# EAGLE design Bugboard (EAGLE 6.6.0)
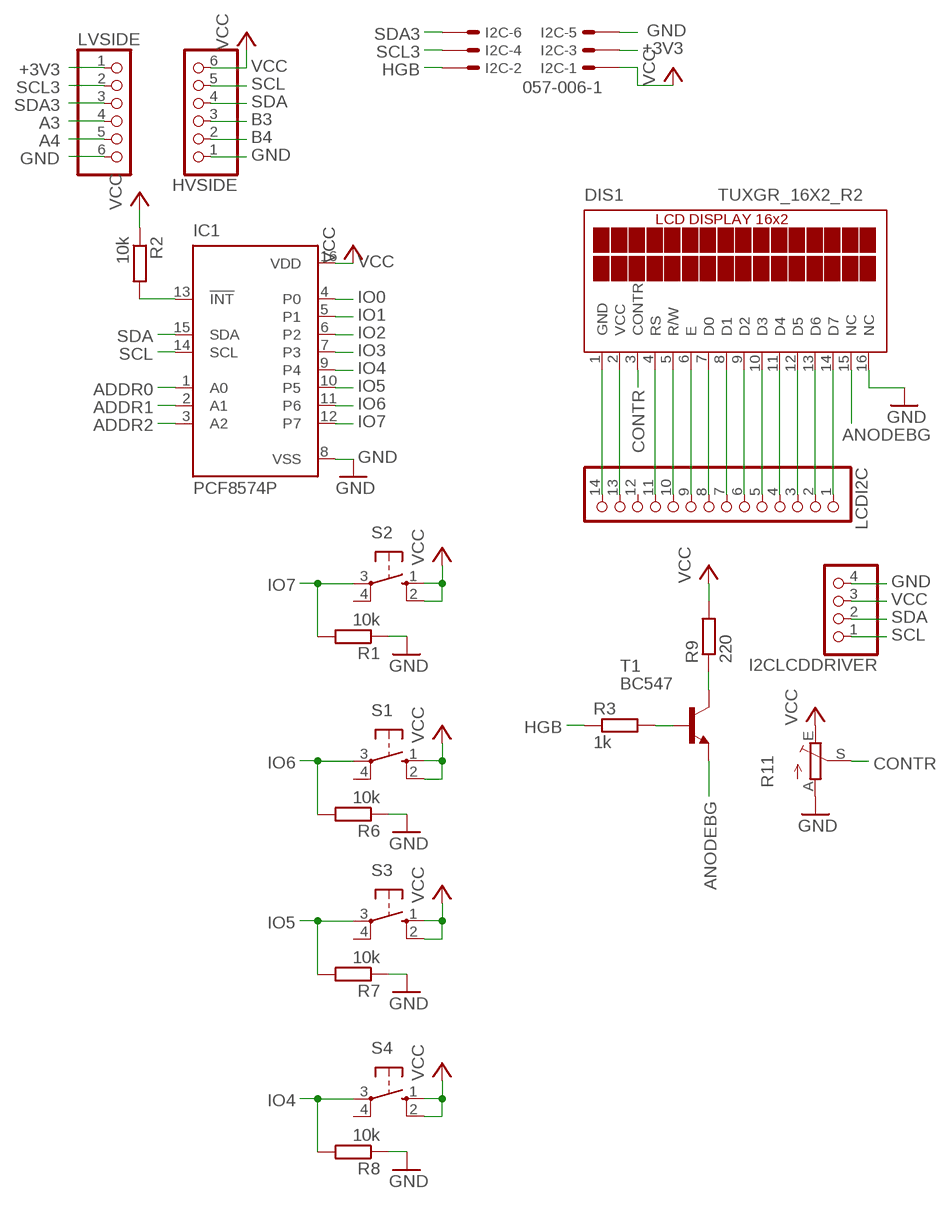
[diagram p0: schematic, sheet 1]

## Parts
DIS1  TUXGR_16X2_R2  [TUXGR_16X2_R2]
HVSIDE  PINHD-1X6  [1X06]
I2C  057-006-1  [057-006-1]
I2CLCDDRIVER  PINHD-1X4  [1X04]
IC1  PCF8574P  [DIL16]
LCDI2C  PINHD-1X14  [1X14]
LVSIDE  PINHD-1X6  [1X06]
R1  10k  R-EU_0204/7  [0204/7]
R2  10k  R-EU_0204/7  [0204/7]
R3  1k  R-EU_0207/12  [0207/12]
R6  10k  R-EU_0204/7  [0204/7]
R7  10k  R-EU_0204/7  [0204/7]
R8  10k  R-EU_0204/7  [0204/7]
R9  220  R-EU_0204/7  [0204/7]
R11  TRIM_EU-B64Y  [B64Y]
S1  10-XX  [B3F-10XX]
S2  10-XX  [B3F-10XX]
S3  10-XX  [B3F-10XX]
S4  10-XX  [B3F-10XX]
T1  BC547  [TO92]

## Nets
+3V3: I2C.3 LVSIDE.1
A3: LVSIDE.4
A4: LVSIDE.5
ADDR0: IC1.1(A0)
ADDR1: IC1.2(A1)
ADDR2: IC1.3(A2)
ANODEBG: DIS1.15(NC) T1.1(E)
B3: HVSIDE.3
B4: HVSIDE.2
CONTR: DIS1.3(CONTR) R11.S
GND: DIS1.1(GND) DIS1.16(NC) HVSIDE.1 I2C.5 I2CLCDDRIVER.4 IC1.8(VSS) LCDI2C.14 LVSIDE.6 R1.1 R6.1 R7.1 R8.1 R11.A
HGB: I2C.2 R3.1
IO0: IC1.4(P0)
IO1: IC1.5(P1)
IO2: IC1.6(P2)
IO3: IC1.7(P3)
IO4: IC1.9(P4) R8.2 S4.3(P)
IO5: IC1.10(P5) R7.2 S3.3(P)
IO6: IC1.11(P6) R6.2 S1.3(P)
IO7: IC1.12(P7) R1.2 S2.3(P)
N$1: IC1.13(!INT) R2.2
N$2: DIS1.14(D7) LCDI2C.1
N$3: DIS1.13(D6) LCDI2C.2
N$4: DIS1.12(D5) LCDI2C.3
N$5: DIS1.11(D4) LCDI2C.4
N$6: DIS1.10(D3) LCDI2C.5
N$7: DIS1.9(D2) LCDI2C.6
N$8: DIS1.8(D1) LCDI2C.7
N$9: DIS1.7(D0) LCDI2C.8
N$10: DIS1.6(E) LCDI2C.9
N$11: DIS1.5(R/W) LCDI2C.10
N$12: DIS1.4(RS) LCDI2C.11
N$13: R9.1 T1.3(C)
N$14: R3.2 T1.2(B)
SCL: HVSIDE.5 I2CLCDDRIVER.1 IC1.14(SCL)
SCL3: I2C.4 LVSIDE.2
SDA: HVSIDE.4 I2CLCDDRIVER.2 IC1.15(SDA)
SDA3: I2C.6 LVSIDE.3
VCC: DIS1.2(VCC) HVSIDE.6 I2C.1 I2CLCDDRIVER.3 IC1.16(VDD) LCDI2C.13 R2.1 R9.2 R11.E S1.1(S) S1.2(S1) S2.1(S) S2.2(S1) S3.1(S) S3.2(S1) S4.1(S) S4.2(S1)
Unconnected: LCDI2C.12 S1.4(P1) S2.4(P1) S3.4(P1) S4.4(P1)

## Library data of the parts
DIS1 = display-lcd:TUXGR_16X2_R2: Tuxgraphics LCD display 16x2 characters reflective, without background light Source: tuxgr_12x2_r2.pdf; OC_FARNELL: unknown; OC_NEWARK: unknown
HVSIDE LVSIDE = pinhead:PINHD-1X6: PIN HEADER
I2C = con-panduit:057-006-: CONNECTOR 6-pin series 057 contact pc board low profile headers; OC_FARNELL: unknown; OC_NEWARK: unknown
I2CLCDDRIVER = pinhead:PINHD-1X4: PIN HEADER
IC1 = micro-philips:PCF8574: I2C-Bus Remote 8-bit I/O expander http://www.semiconductors.philips.com/acrobat_download/datasheets/PCF8574_4.pdf; MPN: PCF8574PN; OC_FARNELL: 204020; OC_NEWARK: 11N8515
LCDI2C = pinhead:PINHD-1X14: PIN HEADER
R1-R3 R6-R9 = resistor:R-EU_: RESISTOR, European symbol
R11 = pot:TRIM_EU-: POTENTIOMETER
S1-S4 = switch-omron:10-XX: OMRON SWITCH; MPN: B3F-1000; OC_FARNELL: 176432; OC_NEWARK: 36M3542
T1 = transistor:BC547: NPN TRANSISTOR

## Board
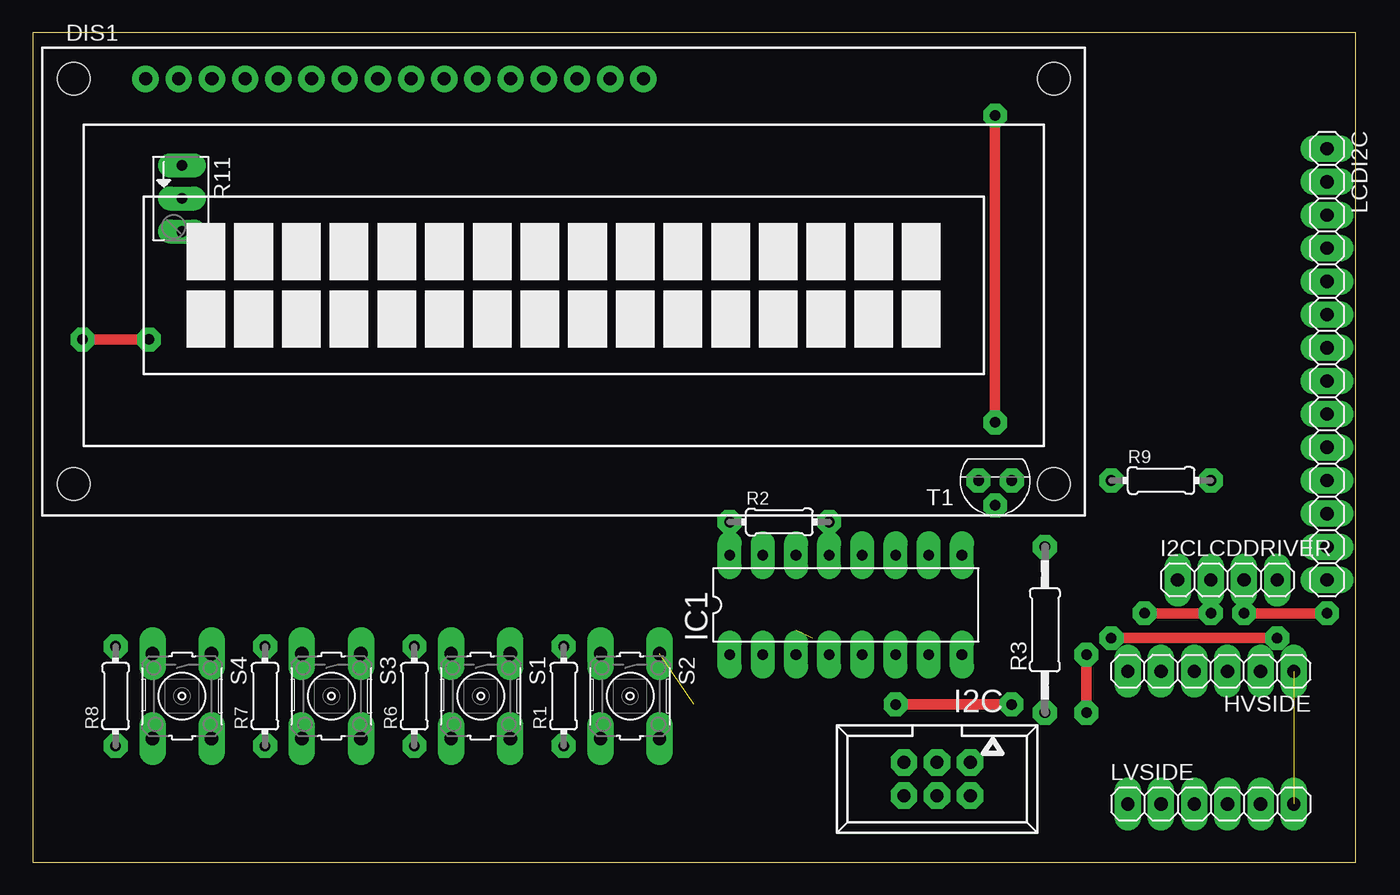
[diagram p1: board, top side]
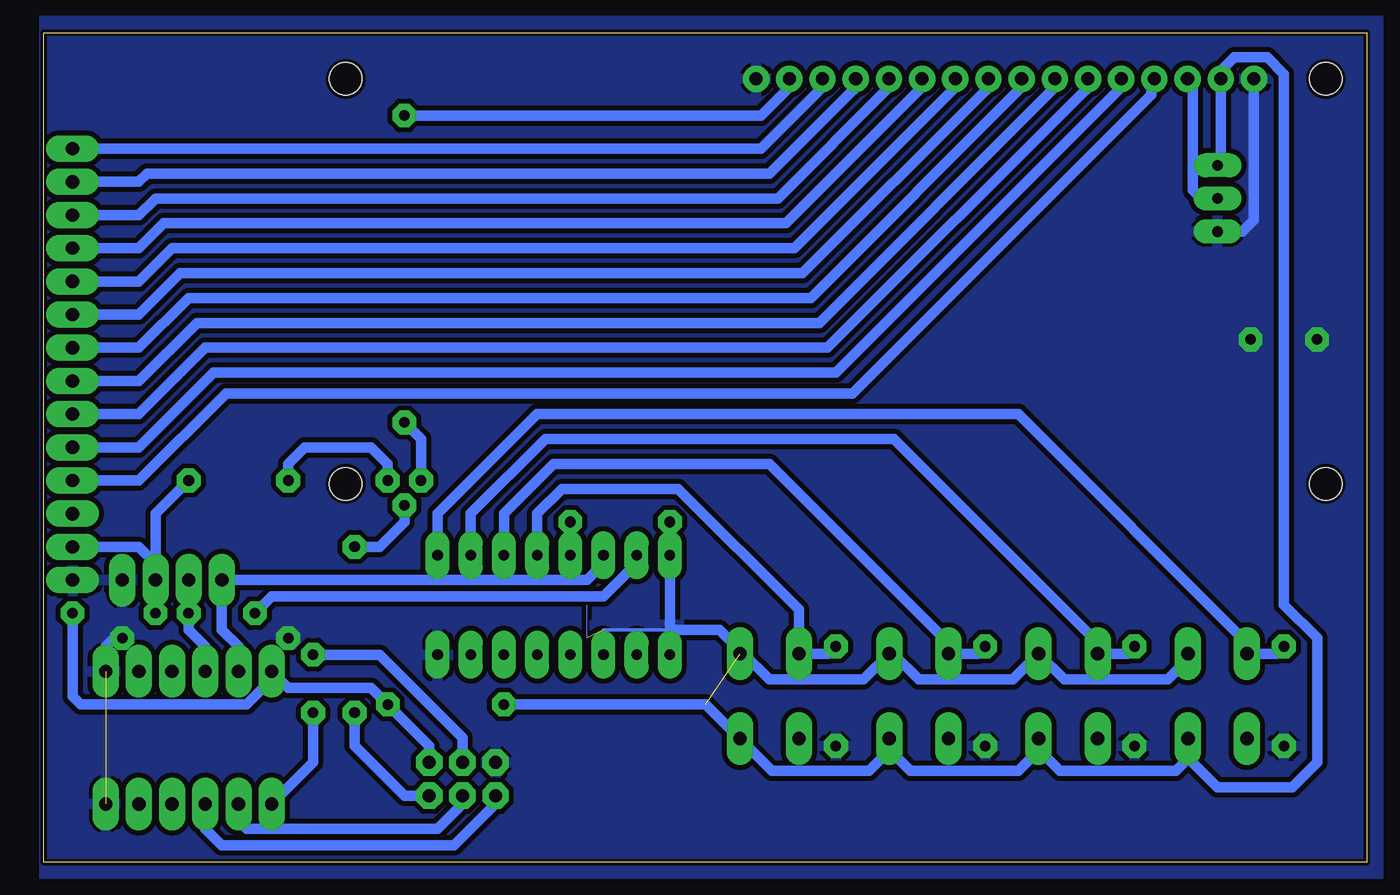
[diagram p2: board, bottom side, seen from below]

Size 101.27 x 63.49 mm. Coordinates in mm from the lower left corner, seen from the top.
Outline: 0,0 101.27,0 101.27,63.49 0,63.49 0,0
Copper layers (1*16): Top 0.035mm / dielectric 1.5mm / Bottom 0.035mm
Design rules "design_rules_pl": minimum track width 20mil, minimum drill 0.8mm, track to track 15mil, track to pad 20mil, pad to pad 20mil, via to via 20mil, smd to smd 8mil, copper to edge 10mil, drill to drill 8mil, minimum pad ring 20mil, minimum via ring 20mil, stop-mask expansion 4mil, vias tented up to drill 0mil, thermal gap 10mil

### Footprints (pad centres in the part's own frame; a part is rotated, then mirrored left to right if it is on the bottom)
TUXGR_16X2_R2 = drill 1 pad 1.676: 1 -32,15.5; 2 -29.46,15.5; 3 -26.92,15.5; 4 -24.38,15.5; 5 -21.84,15.5; 6 -19.3,15.5; 7 -16.76,15.5; 8 -14.22,15.5; 9 -11.68,15.5; 10 -9.14,15.5; 11 -6.6,15.5; 12 -4.06,15.5; 13 -1.52,15.5; 14 1.02,15.5; 15 3.56,15.5; 16 6.1,15.5 | hole 2.5: -37.5,-15.5; 37.5,-15.5; -37.5,15.5; 37.5,15.5
1X06 = drill 1.016 long: 1 -6.35,0; 2 -3.81,0; 3 -1.27,0; 4 1.27,0; 5 3.81,0; 6 6.35,0
057-006-1 = drill 1 octagon: 1 -2.54,-1.27; 2 -2.54,1.27; 3 0,-1.27; 4 0,1.27; 5 2.54,-1.27; 6 2.54,1.27
1X04 = drill 1.016 long: 1 -3.81,0; 2 -1.27,0; 3 1.27,0; 4 3.81,0
DIL16 = drill 0.813 long: 1 -8.89,-3.81; 2 -6.35,-3.81; 3 -3.81,-3.81; 4 -1.27,-3.81; 5 1.27,-3.81; 6 3.81,-3.81; 7 6.35,-3.81; 8 8.89,-3.81; 9 8.89,3.81; 10 6.35,3.81; 11 3.81,3.81; 12 1.27,3.81; 13 -1.27,3.81; 14 -3.81,3.81; 15 -6.35,3.81; 16 -8.89,3.81
1X14 = drill 1.016 long: 1 -16.51,0; 2 -13.97,0; 3 -11.43,0; 4 -8.89,0; 5 -6.35,0; 6 -3.81,0; 7 -1.27,0; 8 1.27,0; 9 3.81,0; 10 6.35,0; 11 8.89,0; 12 11.43,0; 13 13.97,0; 14 16.51,0
0204/7 = drill 0.813 octagon: 1 -3.81,0; 2 3.81,0
0207/12 = drill 0.813 octagon: 1 -6.35,0; 2 6.35,0
B64Y = drill 0.813 long: A 2.54,0; E -2.54,0; S 0,0
B3F-10XX = drill 1.016 long: 1 -3.251,2.261; 2 3.251,2.261; 3 -3.251,-2.261; 4 3.251,-2.261
TO92 = drill 0.813 octagon: 1 1.27,0; 2 0,1.905; 3 -1.27,0

### Placement (x,y rotation side)
DIS1  40.64,44.45 0 top
HVSIDE  90.17,14.6 180 top
I2C  69.22,6.35 180 top
I2CLCDDRIVER  91.44,21.59 0 top
IC1  62.23,19.68 0 top
LCDI2C  99.06,38.1 270 top
LVSIDE  90.17,4.44 0 top
R1  40.64,12.7 90 top
R2  57.15,26.04 0 top
R3  77.47,17.78 90 top
R6  29.21,12.7 90 top
R7  17.78,12.7 90 top
R8  6.35,12.7 90 top
R9  86.36,29.21 0 top
R11  11.43,50.8 270 top
S1  34.29,12.7 270 top
S2  45.72,12.7 270 top
S3  22.86,12.7 270 top
S4  11.43,12.7 270 top
T1  73.66,29.21 180 top

### Tracks (layer width: path | path; a pad name or v marks a point on that pad's centre or on a via)
+3V3  (via drill 0.8)
  Top 0.813: v80.64,15.87 v80.64,11.43
  Bottom 0.813: I2C.3 69.22,9.52 75.56,15.87 v80.64,15.87 | v80.64,11.43 80.64,7.62 LVSIDE.1
ANODEBG  (via drill 0.8)
  Top 0.813: v73.66,33.66 v73.66,57.15
  Bottom 0.813: DIS1.15 44.2,59.3 46.35,57.15 v73.66,57.15 | T1.1 72.39,32.39 v73.66,33.66
CONTR
  Bottom 0.813: R11.S 12.7,50.8 13.34,51.43 13.34,59.56 DIS1.3
GND  (via drill 0.8)  (1 unrouted)
  Top 0.813: v3.81,40 v8.89,40 | v95.25,17.14 v82.55,17.14
  Bottom 0.813: DIS1.1 8.64,49.14 9.53,48.26 R11.A | v95.25,17.14 95.89,17.14 96.52,16.51 HVSIDE.1
  pour Bottom: 52.39,13.97 53.02,14.6 53.66,14.6 54.29,13.97 54.93,13.97 55.56,14.6 56.2,14.6 56.83,13.97 57.47,13.97 58.1,14.6 58.74,14.6 59.37,13.97 59.37,13.33 52.39,13.33
  pour Bottom: -1.27,64.77 -1.27,-1.27 101.6,-1.27 101.6,64.77
HGB
  Bottom 0.813: I2C.2 73.66,5.08 77.47,8.89 R3.1
IO4
  Bottom 0.813: IC1.9 71.12,26.67 63.5,34.29 26.67,34.29 9.17,16.79 S4.3 6.91,15.95 R8.2
IO5
  Bottom 0.813: IC1.10 68.58,26.67 62.87,32.39 36.2,32.39 20.6,16.79 S3.3 18.34,15.95 R7.2
IO6
  Bottom 0.813: IC1.11 66.04,26.67 62.23,30.48 45.72,30.48 32.03,16.79 S1.3 29.77,15.95 R6.2
IO7
  Bottom 0.813: IC1.12 63.5,26.67 61.59,28.57 52.7,28.57 43.46,19.33 S2.3 41.2,15.95 R1.2
N$1
  Bottom 0.813: R2.2 IC1.13
N$2
  Bottom 0.813: DIS1.14 41.66,59.3 46.35,54.61 LCDI2C.1
N$3
  Bottom 0.813: DIS1.13 39.12,59.3 39.37,59.05 45.72,52.7 46.99,52.7 46.35,52.7 93.34,52.7 93.98,52.07 LCDI2C.2
N$4
  Bottom 0.813: DIS1.12 36.58,59.3 45.09,50.8 92.71,50.8 93.98,49.53 LCDI2C.3
N$5
  Bottom 0.813: DIS1.11 34.04,59.3 44.45,48.89 92.08,48.89 93.98,46.99 LCDI2C.4
N$6
  Bottom 0.813: DIS1.10 31.5,59.3 43.81,46.99 91.44,46.99 93.98,44.45 LCDI2C.5
N$7
  Bottom 0.813: LCDI2C.6 93.98,41.91 90.81,45.08 43.83,45.08 43.81,45.08 43.18,45.08 29.21,59.05 28.96,59.3 DIS1.9
N$8
  Bottom 0.813: DIS1.8 26.42,59.3 42.55,43.18 90.17,43.18 93.98,39.37 LCDI2C.7
N$9
  Bottom 0.813: DIS1.7 23.88,59.3 24.13,59.05 41.91,41.27 42.55,41.27 89.53,41.27 93.98,36.83 LCDI2C.8
N$10
  Bottom 0.813: DIS1.6 21.34,59.3 21.59,59.05 41.27,39.37 41.91,39.37 88.9,39.37 93.98,34.29 LCDI2C.9
N$11
  Bottom 0.813: DIS1.5 18.8,59.3 19.05,59.05 40.64,37.47 41.27,37.47 88.27,37.47 93.98,31.75 LCDI2C.10
N$12
  Bottom 0.813: DIS1.4 16.26,59.3 16.51,59.05 16.51,58.74 39.37,35.88 87.31,35.88 93.98,29.21 LCDI2C.11
N$13
  Bottom 0.813: R9.1 82.55,30.48 81.28,31.75 76.2,31.75 74.93,30.48 T1.3
N$14
  Bottom 0.813: T1.2 73.66,26.04 75.56,24.13 R3.2
N$15
  pour Bottom: -1.27,64.77 -1.27,-1.27 101.6,-1.27 101.6,64.77
N$16  (via drill 0.8)
  other vias: 92.71,19.05
N$17  (via drill 0.8)
  other vias: 99.06,19.05
SCL
  Bottom 0.813: IC1.14 58.42,22.86 59.69,21.59 I2CLCDDRIVER.1 87.63,17.78 86.36,16.51 HVSIDE.5
SCL3
  Bottom 0.813: I2C.4 69.22,4.44 71.12,2.54 85.72,2.54 86.36,3.17 LVSIDE.2
SDA  (via drill 0.8)
  Top 0.813: v85.09,19.05 v90.17,19.05
  Bottom 0.813: IC1.15 55.88,22.86 58.42,20.32 83.82,20.32 v85.09,19.05 | I2CLCDDRIVER.2 v90.17,19.05 90.17,17.78 88.9,16.51 HVSIDE.4
SDA3
  Bottom 0.813: I2C.6 66.67,4.44 69.85,1.27 87.63,1.27 88.9,2.54 LVSIDE.3
VCC  (via drill 0.8)  (2 unrouted)
  Top 0.813: v66.04,12.06 v74.93,12.06 | v99.06,19.05 v92.71,19.05
  Bottom 0: 59.69,17.14 59.69,19.68
  Bottom 0.254: 53.34,17.78 58.42,17.78
  Bottom 0.813: R2.1 IC1.16 53.34,17.78 49.53,17.78 47.98,16.23 S2.1 47.7,15.95 45.72,13.97 38.53,13.97 S1.1 36.27,15.95 34.29,13.97 27.1,13.97 S3.1 23.14,13.97 15.24,13.97 13.69,15.52 S4.1 | 25.4,8.25 24.77,8.25 23.5,6.98 14.61,6.98 13.69,7.9 S4.2 13.69,7.98 11.43,5.71 5.71,5.71 3.81,7.62 3.81,17.14 6.35,19.68 6.35,60.32 7.62,61.59 10.16,61.59 11.18,60.57 DIS1.2 11.18,53.59 R11.E | 25.4,8.25 26.67,6.98 34.92,6.98 36.2,8.25 36.83,8.25 | 36.83,8.25 38.1,6.98 45.52,6.98 S2.2 50.6,12.06 v66.04,12.06 | S1.2 36.55,8.53 36.83,8.25 | S3.2 25.12,8.53 25.4,8.25 | LCDI2C.13 93.98,24.13 92.71,22.86 | 92.71,22.86 I2CLCDDRIVER.3 v92.71,19.05 | R9.2 92.71,26.67 92.71,22.86 | I2C.1 71.75,8.89 v74.93,12.06 76.2,13.33 82.55,13.33 HVSIDE.6 83.82,13.97 85.72,12.06 98.42,12.06 99.06,12.7 v99.06,19.05
  pour Bottom: 59.37,17.78 58.74,17.14 58.1,17.14 57.47,17.78 56.83,17.78 56.2,17.14 55.56,17.14 54.93,17.78 54.29,17.78 53.66,17.14 53.02,17.14 52.39,17.78 52.39,18.41 59.37,18.41